# Altium project Dental Support.PrjPcb
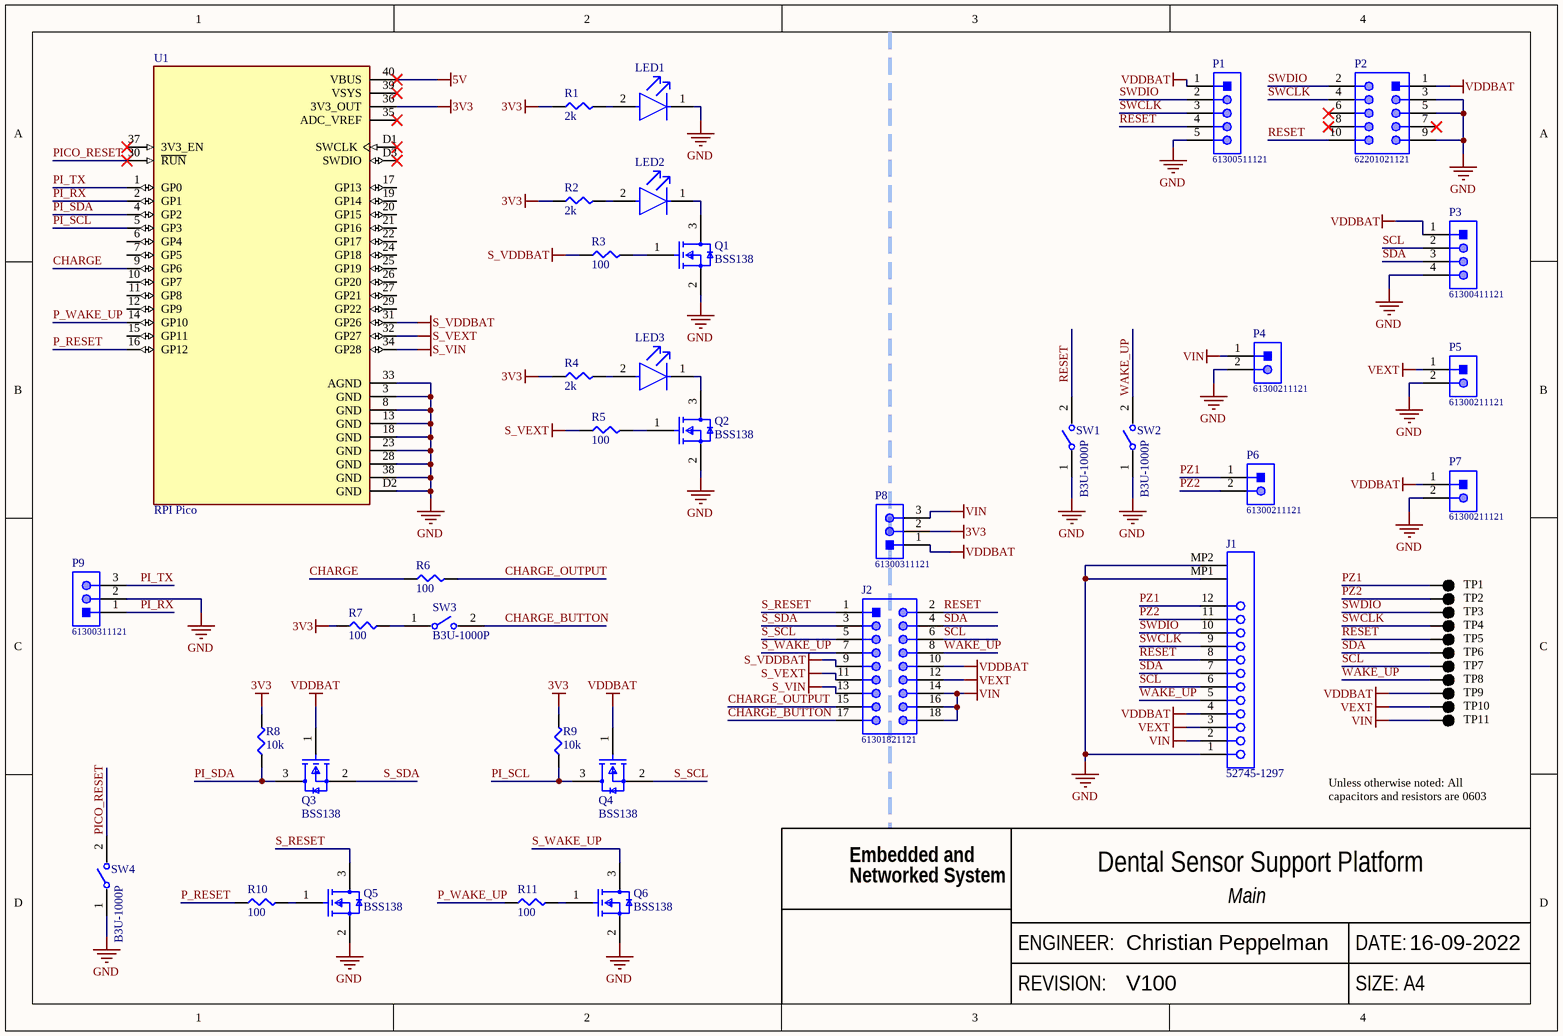
[diagram p0: Dental Support.SchDoc]
1 sheet, 47 parts. Net scope: global (net labels, ports and power ports of the same name join across sheets).
Board file: Dental Support.PcbDoc

## Sheet Dental Support.SchDoc
size A4; Date: 16-09-2022; Engineer: Christian Peppelman; Revision: V100; SheetNumber: 1; SheetTotal: 1; ProjectSheetName: Dental Sensor Support Platform; SheetName: Main

### Parts
J1  52745-1297  [MOLX-52745-1297]
J2  61301821121  [61301821121]
LED1  150080SS75000  [FP-150080SS75000-MFG]  (value not drawn)
LED2  150080SS75000  [FP-150080SS75000-MFG]  (value not drawn)
LED3  150080SS75000  [FP-150080SS75000-MFG]  (value not drawn)
P1  61300511121  [61300511121]
P2  62201021121  [62201021121]
P3  61300411121  [61300411121]
P4  61300211121  [61300211121]
P5  61300211121  [61300211121]
P6  61300211121  [61300211121]
P7  61300211121  [61300211121]
P8  61300311121  [61300311121]
P9  61300311121  [61300311121]
Q1  BSS138  [FP-318-08-IPC_B]
Q2  BSS138  [FP-318-08-IPC_B]
Q3  BSS138  [FP-318-08-IPC_B]
Q4  BSS138  [FP-318-08-IPC_B]
Q5  BSS138  [FP-318-08-IPC_B]
Q6  BSS138  [FP-318-08-IPC_B]
R1  2k  [RESC2012X06N]
R2  2k  [RESC2012X06N]
R3  100  [RESC2012X06N]
R4  2k  [RESC2012X06N]
R5  100  [RESC2012X06N]
R6  100  [RESC2012X06N]
R7  100  [RESC2012X06N]
R8  10k  [RESC2012X06N]
R9  10k  [RESC2012X06N]
R10  100  [RESC2012X06N]
R11  100  [RESC2012X06N]
SW1  B3U-1000P  [FP-B3U-1000P-MFG]
SW2  B3U-1000P  [FP-B3U-1000P-MFG]
SW3  B3U-1000P  [FP-B3U-1000P-MFG]
SW4  B3U-1000P  [FP-B3U-1000P-MFG]
TP1  5011  [KSTN-5011_V]  (value not drawn)
TP2  5011  [KSTN-5011_V]  (value not drawn)
TP3  5011  [KSTN-5011_V]  (value not drawn)
TP4  5011  [KSTN-5011_V]  (value not drawn)
TP5  5011  [KSTN-5011_V]  (value not drawn)
TP6  5011  [KSTN-5011_V]  (value not drawn)
TP7  5011  [KSTN-5011_V]  (value not drawn)
TP8  5011  [KSTN-5011_V]  (value not drawn)
TP9  5011  [KSTN-5011_V]  (value not drawn)
TP10  5011  [KSTN-5011_V]  (value not drawn)
TP11  5011  [KSTN-5011_V]  (value not drawn)
U1  RPI Pico  [RPI Pico]

### Nets
3V3: P8.2 R1.1 R2.1 R4.1 R7.1 R8.2 R9.2 U1.36(3V3_OUT)
5V: U1.40(VBUS)
GND: J1.1 J1.MP1 J1.MP2 LED1.1(C) P1.5 P2.3 P2.5 P2.9 P3.4 P4.2 P5.2 P7.2 P9.2 Q1.2(S) Q2.2(S) Q5.2(S) Q6.2(S) SW1.1 SW2.1 SW4.1 U1.3(GND) U1.8(GND) U1.13(GND) U1.18(GND) U1.23(GND) U1.28(GND) U1.33(AGND) U1.38(GND) U1.D2(GND)
S_VDDBAT: J2.9 R3.1 U1.31(GP26)
S_VEXT: J2.11 R5.1 U1.32(GP27)
S_VIN: J2.13 U1.34(GP28)
VDDBAT: J1.4 J2.10 P1.1 P2.1 P3.1 P7.1 P8.1 Q3.1(G) Q4.1(G) TP9.1
VEXT: J1.3 J2.12 P5.1 TP10.1
VIN: J1.2 J2.14 J2.16 J2.18 P4.1 P8.3 TP11.1
CHARGE: R6.1 U1.9(GP6)
CHARGE_BUTTON: J2.17 SW3.2
CHARGE_OUTPUT: J2.15 R6.2
P_RESET: R10.1 U1.16(GP12)
P_WAKE_UP: R11.1 U1.14(GP10)
PI_RX: P9.1 U1.2(GP1)
PI_SCL: Q4.3(D) R9.1 U1.5(GP3)
PI_SDA: Q3.3(D) R8.1 U1.4(GP2)
PI_TX: P9.3 U1.1(GP0)
PICO_RESET: SW4.2 U1.30(~{RUN})
PZ1: J1.12 P6.1 TP1.1
PZ2: J1.11 P6.2 TP2.1
RESET: J1.8 J2.2 P1.4 P2.10 SW1.2 TP5.1
S_RESET: J2.1 Q5.3(D)
S_SCL: J2.5 Q4.2(S)
S_SDA: J2.3 Q3.2(S)
S_WAKE_UP: J2.7 Q6.3(D)
SCL: J1.6 J2.6 P3.2 TP7.1
SDA: J1.7 J2.4 P3.3 TP6.1
SWCLK: J1.9 P1.3 P2.4 TP4.1
SWDIO: J1.10 P1.2 P2.2 TP3.1
WAKE_UP: J1.5 J2.8 SW2.2 TP8.1
NetLED1_2: LED1.2(A) R1.2
NetLED2_1: LED2.1(C) Q1.3(D)
NetLED2_2: LED2.2(A) R2.2
NetLED3_1: LED3.1(C) Q2.3(D)
NetLED3_2: LED3.2(A) R4.2
NetQ1_1: Q1.1(G) R3.2
NetQ2_1: Q2.1(G) R5.2
NetQ5_1: Q5.1(G) R10.2
NetQ6_1: Q6.1(G) R11.2
NetR7_2: R7.2 SW3.1

Not connected (* = marked no-connect by the designer): P2 6* 7* 8*; U1 6(GP4) 7(GP5) 10(GP7) 11(GP8) 12(GP9) 15(GP11) 17(GP13) 19(GP14) 20(GP15) 21(GP16) 22(GP17) 24(GP18) 25(GP19) 26(GP20) 27(GP21) 29(GP22) 35(ADC_VREF)* 37(3V3_EN)* 39(VSYS)* D1(SWCLK)* D3(SWDIO)*

### Notes on the sheet
- Unless otherwise noted: All capacitors and resistors are 0603
- Embedded and
- Networked System
- ENGINEER:
- DATE:
- REVISION:
- SIZE: A4

### Library data of the parts
J1 = CMP-1241-00358-1: 0.5 mm Pitch Easy-On(TM) Type FPC Connector, 2.0 mm Mated Height, Right Angle, ZIF, SMT, Top Contact, 12 Circuits, -20 to 85 degC, ELV and RoHS Compliant, Tape and Reel; Manufacturer: Molex; PCB Locator: No; Material - Plating Termination: Gold; Voltage (Max): 50V; Durability (mating cycles max): 20; Circuits (Loaded): 12; Material - Metal: Phosphor Bronze; PCB Retention: Yes; Entry Angle: 90degrees Angle; Pitch - Mating Interface: 0.50mm; Current (Max per Contact): 0.5A; Mated Height: 2.00mm; ComponentLink2Description: Datasheet; PartNumber: 52745-1297; ComponentLink2URL: http://www.molex.com/webdocs/datasheets/pdf/en-us/0527451297_FFC_FPC_CONNECTORS.pdf; Orientation: Right Angle; ComponentLink3Description: Package Specification; RoHS: TRUE; Mounting Technology: Surface Mount; Number of Rows: 1; PackageReference: 52745-1297; Stackable: No; Material - Plating Mating: Gold; ComponentLink1Description: Manufacturer URL; PackageVersion: Rev. C, 07/2010; ComponentLink3URL: http://www.molex.com/pdm_docs/sd/527451297_sd.pdf; Packing: Tape and Reel; ComponentLink1URL: http://www.molex.com/molex/index.jsp; Contact Position: Top; Polarized to PCB: Yes; PackageDescription: 12-Lead FPC Connector, Pitch 0.5 mm
J2 = CMP-1502-01101-1: THT Vertical Pin Header WR-PHD, Pitch 2.54 mm, Dual Row, 18 pins; Manufacturer: Wurth Elektronik; Withstanding Voltage: 500VAC; Pin Number: 18; Pitch: 2.54mm; Rated Current: 3A; Contact Resistance: 20mOhm; Gender: Male; Working Voltage: 250VAC; Publisher: WurthElektronik; Packaging: Bag; Row Number: Dual; Datasheet URL: https://katalog.we-online.de/em/datasheet/6130xx21121.pdf; Mounting Technology: THT; Orientation: Vertical; Part Number: 61301821121; Package Reference: 61301821121; Manufacturer URL: http://www.we-online.de; Operating Temperature: -40to105degC
LED1-LED3 = CMP-1426-00010-2: LED RED CLEAR 0805 SMD; Forward Voltage: 1.9V; Luminous Intensity: 60mcd; Dominant Wavelength: 630nm; Forward Current: 30mA; Viewing Angle: 140°; Lens Color: Colorless; Test Current: 20mA; Lens Size: 1.25mm; Packaging: Cut Tape; Width: 1.25mm; Case Code (Metric): 2012; Max Operating Temperature: 85°C; RoHS Compliant: Yes; Mount: Surface Mount; Case/Package: 0805; Series: WL-SMCW; Length: 2mm; Case Code (Imperial): 0805; Wavelength: 630nm; Lens Style: Clear; Min Operating Temperature: -40°C; Color: Red; Lens Transparency: Clear; Package Quantity: 1; Height: 0.8mm
P1 = CMP-1502-01068-1: THT Vertical Pin Header WR-PHD, Pitch 2.54 mm, Single Row, 5 pins; Manufacturer: Wurth Elektronik; Pin Number: 5; Contact Resistance: 20mOhm; Working Voltage: 250VAC; Pitch: 2.54mm; Withstanding Voltage: 500VAC; Rated Current: 3A; Gender: Male; Datasheet URL: https://katalog.we-online.de/em/datasheet/6130xx11121.pdf; Orientation: Vertical; Mounting Technology: THT; Row Number: Single; Package Reference: 61300511121; Publisher: WurthElektronik; Part Number: 61300511121; Packaging: Bag; Manufacturer URL: http://www.we-online.de; Operating Temperature: -40to105degC
P2 = CMP-1502-00948-1: THT Vertical Pin Header WR-PHD, Pitch 1.27 mm, Dual Row, 10 pins; Manufacturer: Wurth Elektronik; Rated Current: 1A; Pin Number: 10; Working Voltage: 100VAC; Contact Resistance: 20mOhm; Withstanding Voltage: 500VAC; Pitch: 1.27mm; Gender: Male; Mounting Technology: THT; Manufacturer URL: http://www.we-online.de; Package Reference: 62201021121; Row Number: Dual; Datasheet URL: https://katalog.we-online.de/em/datasheet/62201021121.pdf; Publisher: WurthElektronik; Packaging: Box; Operating Temperature: -40to105degC; Orientation: Vertical; Part Number: 62201021121
P3 = CMP-1502-01064-1: THT Vertical Pin Header WR-PHD, Pitch 2.54 mm, Single Row, 4 pins; Manufacturer: Wurth Elektronik; Withstanding Voltage: 500VAC; Rated Current: 3A; Working Voltage: 250VAC; Pin Number: 4; Gender: Male; Contact Resistance: 20mOhm; Pitch: 2.54mm; Manufacturer URL: http://www.we-online.de; Operating Temperature: -40to105degC; Packaging: Bag; Mounting Technology: THT; Package Reference: 61300411121; Datasheet URL: https://katalog.we-online.de/em/datasheet/6130xx11121.pdf; Publisher: WurthElektronik; Part Number: 61300411121; Row Number: Single; Orientation: Vertical
P4-P7 = CMP-1712-00002-4: THT Vertical Pin Header WR-PHD, Pitch 2.54 mm, Single Row, 2 pins; Manufacturer: Wurth Elektronik; Rated Current: 3A; Gender: Male; Withstanding Voltage: 500VAC; Working Voltage: 250VAC; Pitch: 2.54mm; Contact Resistance: 20mOhm; Pin Number: 2; Mounting Technology: THT; Orientation: Vertical; Operating Temperature: -40to105degC; Packaging: Bag; Publisher: WurthElektronik; Datasheet URL: https://katalog.we-online.de/em/datasheet/6130xx11121.pdf; Manufacturer URL: http://www.we-online.de; Row Number: Single; Package Reference: 61300211121; Part Number: 61300211121
P8 P9 = CMP-1502-01062-1: THT Vertical Pin Header WR-PHD, Pitch 2.54 mm, Single Row, 3 pins; Manufacturer: Wurth Elektronik; Withstanding Voltage: 500VAC; Working Voltage: 250VAC; Rated Current: 3A; Pitch: 2.54mm; Pin Number: 3; Gender: Male; Contact Resistance: 20mOhm; Package Reference: 61300311121; Manufacturer URL: http://www.we-online.de; Datasheet URL: https://katalog.we-online.de/em/datasheet/6130xx11121.pdf; Operating Temperature: -40to105degC; Part Number: 61300311121; Orientation: Vertical; Packaging: Bag; Row Number: Single; Mounting Technology: THT; Publisher: WurthElektronik
Q1-Q6 = CMP-07173-000101-1: MOSFET N-CH 50V 220MA SOT-23; Turn-Off Delay Time: 20ns; Element Configuration: Single; Rds On Max: 3.5R; Gate to Source Voltage (Vgs): 20V; Threshold Voltage: 1.3V; Number of Elements: 1; Power Dissipation: 360mW; Rise Time: 9ns; Turn-On Delay Time: 2.5ns; Input Capacitance: 27pF; On-State Resistance: 6R; Lead Free: Lead Free; Length: 2.92mm; Width: 1.3mm; Drain to Source Breakdown Voltage: 50V; Min Operating Temperature: -55°C; REACH SVHC: No SVHC; Packaging: Tape and Reel; Radiation Hardening: No; Height: 0.93mm; Drain to Source Voltage (Vdss): 50V; Current Rating: 220mA; Voltage Rating (DC): 50V; Weight: 0.03g; Continuous Drain Current (ID): 220mA; Number of Pins: 3; Nominal Vgs: 1.3V; Max Power Dissipation: 360mW; Fall Time: 9ns; Drain to Source Resistance: 3.5R; Contact Plating: Tin; Case/Package: SOT-23; Package Quantity: 1; Dual Supply Voltage: 50V; Mount: Surface Mount; Termination: SMD/SMT; Max Operating Temperature: 150°C
R1 R2 R4 = ERJ-6ENF2001V: RES SMD 2K OHM 1% 1/8W 0805; Manufacturer: Panasonic Electronic Components; Factory Stock: 0; Unit Price (USD): 0.00729; @ qty: 1500; Minimum Quantity: 1; Power (Watts): 0.125W, 1/8W; Temperature Coefficient: ±100ppm/°C; Part Number: ERJ-6ENF2001V; Datasheets: http://industrial.panasonic.com/www-cgi/jvcr13pz.cgi?E+PZ+3+AOA0002+ERJ6ENF2001V+7+WW; Image: //media.digikey.com/Renders/Panasonic%20Renders/ERJ-0805%20Pkg.jpg; Digi-Key Part Number: P2.00KCCT-ND; Quantity Available: 732688; Packaging: Cut Tape (CT); Series: ERJ; Part Status: Active; Value: 2k; Tolerance: ±1%; Composition: Thick Film; Features: Automotive AEC-Q200; Operating Temperature: -55°C ~ 155°C; Package / Case: 0805 (2012 Metric); Supplier Device Package: 0805; Size / Dimension: 0.079" L x 0.049" W (2.00mm x 1.25mm); Height - Seated (Max): 0.028" (0.70mm); Number of Terminations: 2; Failure Rate: -
R3 R5-R7 R10 R11 = ERJ-6ENF1000V: RES SMD 100 OHM 1% 1/8W 0805; Manufacturer: Panasonic Electronic Components; Factory Stock: 0; Unit Price (USD): 0.00729; @ qty: 1500; Minimum Quantity: 1; Power (Watts): 0.125W, 1/8W; Temperature Coefficient: ±100ppm/°C; Part Number: ERJ-6ENF1000V; Datasheets: http://industrial.panasonic.com/www-cgi/jvcr13pz.cgi?E+PZ+3+AOA0002+ERJ6ENF1000V+7+WW; Image: //media.digikey.com/Renders/Panasonic%20Renders/ERJ-0805%20Pkg.jpg; Digi-Key Part Number: P100CCT-ND; Quantity Available: 288663; Packaging: Cut Tape (CT); Series: ERJ; Part Status: Active; Value: 100; Tolerance: ±1%; Composition: Thick Film; Features: Automotive AEC-Q200; Operating Temperature: -55°C ~ 155°C; Package / Case: 0805 (2012 Metric); Supplier Device Package: 0805; Size / Dimension: 0.079" L x 0.049" W (2.00mm x 1.25mm); Height - Seated (Max): 0.028" (0.70mm); Number of Terminations: 2; Failure Rate: -
R8 R9 = ERJ-6ENF1002V: RES SMD 10K OHM 1% 1/8W 0805; Manufacturer: Panasonic Electronic Components; Factory Stock: 0; Unit Price (USD): 0.00729; @ qty: 1500; Minimum Quantity: 1; Power (Watts): 0.125W, 1/8W; Temperature Coefficient: ±100ppm/°C; Part Number: ERJ-6ENF1002V; Datasheets: http://industrial.panasonic.com/www-cgi/jvcr13pz.cgi?E+PZ+3+AOA0002+ERJ6ENF1002V+7+WW; Image: //media.digikey.com/Renders/Panasonic%20Renders/ERJ-0805%20Pkg.jpg; Digi-Key Part Number: P10.0KCCT-ND; Quantity Available: 3985614; Packaging: Cut Tape (CT); Series: ERJ; Part Status: Active; Value: 10k; Tolerance: ±1%; Composition: Thick Film; Features: Automotive AEC-Q200; Operating Temperature: -55°C ~ 155°C; Package / Case: 0805 (2012 Metric); Supplier Device Package: 0805; Size / Dimension: 0.079" L x 0.049" W (2.00mm x 1.25mm); Height - Seated (Max): 0.028" (0.70mm); Number of Terminations: 2; Failure Rate: -
SW1-SW4 = CMP-2100-03586-2: SWITCH TACTILE SPST-NO 0.05A 12V; Contact Resistance: 100mR; Operating Force: 1.5N; Max Current Rating: 50mA; Switch Travel: 0.15mm; Actuator Type: Standard; Mechanical Life: 200000Cycles; Ratings: Dust Proof; Illumination Type: Non-Illuminated; Throw Configuration: SPST; Actuator Length: 0.4mm; Switch Function: Off-Mom; Height: 1.2mm; Width: 3mm; Weight: 0.000776oz; Contact Material: Silver; Max Voltage Rating (DC): 12V; Insulation Resistance: 100MR; Lead Free: Lead Free; Current Rating: 50mA; Termination: SMD/SMT; Length: 4mm; Voltage Rating (DC): 12V; Contact Current Rating: 50mA; Orientation: Straight; Depth: 2.5mm; Max Operating Temperature: 70°C; Packaging: Tape and Reel; Min Operating Temperature: -25°C; Package Quantity: 1; Mount: Surface Mount; Electrical Life: 200000Cycles
TP1-TP11 = CMP-1672-00003-4: Test Point, Black, Through Hole, RoHS, Bulk; Manufacturer: Keystone; ComponentLink2URL: http://www.keyelco.com/product-pdf.cfm?p=1320; Colour: Black; Pins: 1; REACH SVHC: No SVHC; ComponentLink1URL: http://www.keyelco.com/; PackageReference: 5011; Contact Plating: Silver; Package Quantity: 100; Packaging: Bulk; RoHSCompliant: true; Height: 8.12 mm; PackageDescription: 1-Pin Through Hole Device, Dia 3.17 mm; Mount: Through Hole; Mounting Technology: Through Hole; DatasheetVersion: Rev. F, 12/2013; ComponentLink1Description: Manufacturer URL; Contact Material: Bronze; ComponentLink2Description: Datasheet